# EAGLE design sec_board (EAGLE 8.3.0)
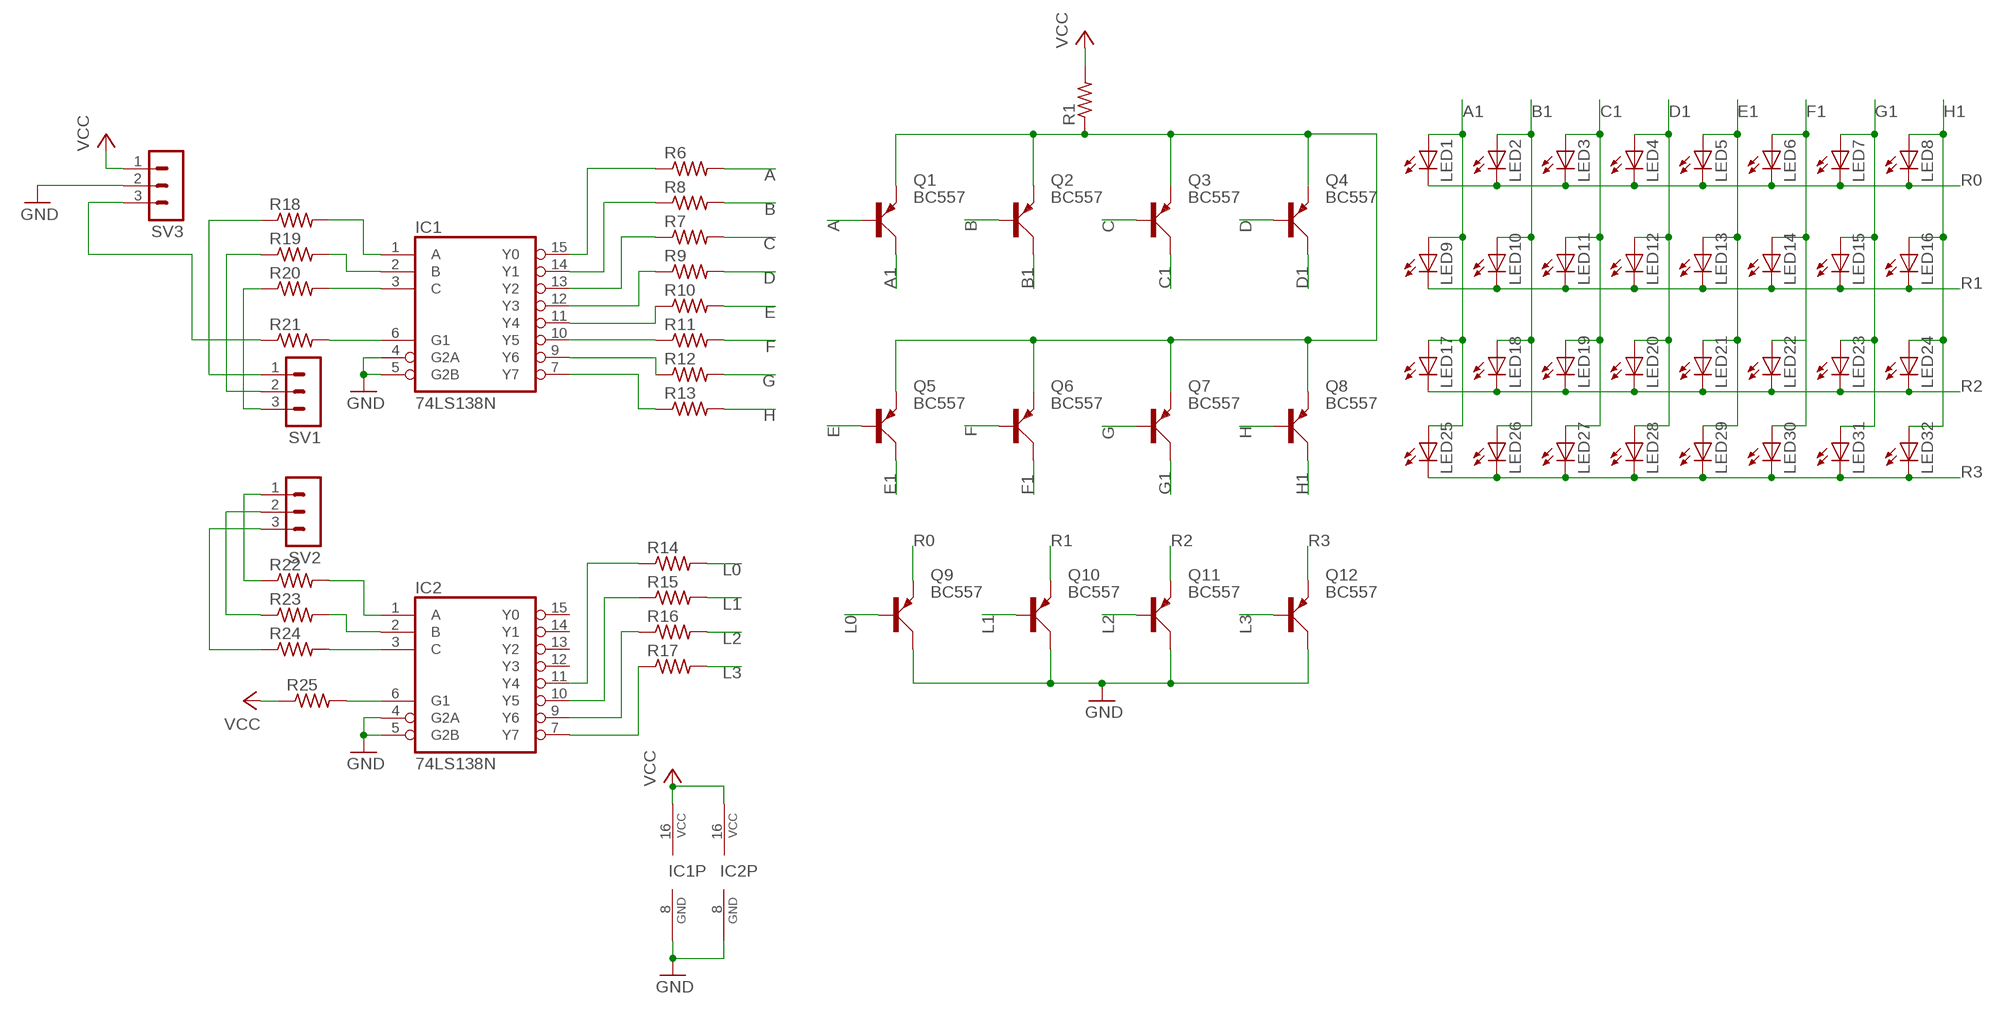
[diagram p0: schematic, sheet 1]

## Parts
IC1  74LS138N  [DIL16]
IC2  74LS138N  [DIL16]
LED1  LED5MM  [LED5MM]
LED2  LED5MM  [LED5MM]
LED3  LED5MM  [LED5MM]
LED4  LED5MM  [LED5MM]
LED5  LED5MM  [LED5MM]
LED6  LED5MM  [LED5MM]
LED7  LED5MM  [LED5MM]
LED8  LED5MM  [LED5MM]
LED9  LED5MM  [LED5MM]
LED10  LED5MM  [LED5MM]
LED11  LED5MM  [LED5MM]
LED12  LED5MM  [LED5MM]
LED13  LED5MM  [LED5MM]
LED14  LED5MM  [LED5MM]
LED15  LED5MM  [LED5MM]
LED16  LED5MM  [LED5MM]
LED17  LED5MM  [LED5MM]
LED18  LED5MM  [LED5MM]
LED19  LED5MM  [LED5MM]
LED20  LED5MM  [LED5MM]
LED21  LED5MM  [LED5MM]
LED22  LED5MM  [LED5MM]
LED23  LED5MM  [LED5MM]
LED24  LED5MM  [LED5MM]
LED25  LED5MM  [LED5MM]
LED26  LED5MM  [LED5MM]
LED27  LED5MM  [LED5MM]
LED28  LED5MM  [LED5MM]
LED29  LED5MM  [LED5MM]
LED30  LED5MM  [LED5MM]
LED31  LED5MM  [LED5MM]
LED32  LED5MM  [LED5MM]
Q1  BC557  [SOT54A]
Q2  BC557  [SOT54A]
Q3  BC557  [SOT54A]
Q4  BC557  [SOT54A]
Q5  BC557  [SOT54A]
Q6  BC557  [SOT54A]
Q7  BC557  [SOT54A]
Q8  BC557  [SOT54A]
Q9  BC557  [SOT54A]
Q10  BC557  [SOT54A]
Q11  BC557  [SOT54A]
Q12  BC557  [SOT54A]
R1  R-US_R0805  [R0805]
R6  R-US_R0805  [R0805]
R7  R-US_R0805  [R0805]
R8  R-US_R0805  [R0805]
R9  R-US_R0805  [R0805]
R10  R-US_R0805  [R0805]
R11  R-US_R0805  [R0805]
R12  R-US_R0805  [R0805]
R13  R-US_R0805  [R0805]
R14  R-US_R0805  [R0805]
R15  R-US_R0805  [R0805]
R16  R-US_R0805  [R0805]
R17  R-US_R0805  [R0805]
R18  R-US_M0805  [M0805]
R19  R-US_M0805  [M0805]
R20  R-US_M0805  [M0805]
R21  R-US_M0805  [M0805]
R22  R-US_M0805  [M0805]
R23  R-US_M0805  [M0805]
R24  R-US_M0805  [M0805]
R25  R-US_M0805  [M0805]
SV1  MA03-1  [MA03-1]
SV2  MA03-1  [MA03-1]
SV3  MA03-1  [MA03-1]

## Nets
A: Q1.B R6.2
A1: LED1.A LED9.A LED17.A LED25.A Q1.C
B: Q2.B R8.2
B1: LED2.A LED10.A LED18.A LED26.A Q2.C
C: Q3.B R7.2
C1: LED3.A LED11.A LED19.A LED27.A Q3.C
D: Q4.B R9.2
D1: LED4.A LED12.A LED20.A LED28.A Q4.C
E: Q5.B R10.2
E1: LED5.A LED13.A LED21.A LED29.A Q5.C
F: Q6.B R11.2
F1: LED6.A LED14.A LED22.A LED30.A Q6.C
G: Q7.B R12.2
G1: LED7.A LED15.A LED23.A LED31.A Q7.C
GND: IC1.4(G2A) IC1.5(G2B) IC1.8(GND) IC2.4(G2A) IC2.5(G2B) IC2.8(GND) Q9.C Q10.C Q11.C Q12.C SV3.2
H: Q8.B R13.2
H1: LED8.A LED16.A LED24.A LED32.A Q8.C
L0: Q9.B R14.2
L1: Q10.B R15.2
L2: Q11.B R16.2
L3: Q12.B R17.2
N$1: IC2.7(Y7) R17.1
N$2: IC1.15(Y0) R6.1
N$4: IC1.14(Y1) R8.1
N$5: IC2.9(Y6) R16.1
N$6: IC1.13(Y2) R7.1
N$7: IC1.12(Y3) R9.1
N$8: IC1.11(Y4) R10.1
N$9: IC1.10(Y5) R11.1
N$10: IC1.9(Y6) R12.1
N$11: IC1.7(Y7) R13.1
N$12: IC2.10(Y5) R15.1
N$13: IC2.11(Y4) R14.1
N$14: Q1.E Q2.E Q3.E Q4.E Q5.E Q6.E Q7.E Q8.E R1.1
N$22: R24.1 SV2.3
N$23: R23.1 SV2.2
N$24: R22.1 SV2.1
N$25: R20.1 SV1.3
N$26: R19.1 SV1.2
N$27: R18.1 SV1.1
N$31: R21.1 SV3.3
N$38: IC2.3(C) R24.2
N$39: IC2.2(B) R23.2
N$40: IC2.1(A) R22.2
N$41: IC1.3(C) R20.2
N$42: IC1.2(B) R19.2
N$43: IC1.1(A) R18.2
N$45: IC1.6(G1) R21.2
N$48: IC2.6(G1) R25.2
R0: LED1.K(C) LED2.K(C) LED3.K(C) LED4.K(C) LED5.K(C) LED6.K(C) LED7.K(C) LED8.K(C) Q9.E
R1: LED9.K(C) LED10.K(C) LED11.K(C) LED12.K(C) LED13.K(C) LED14.K(C) LED15.K(C) LED16.K(C) Q10.E
R2: LED17.K(C) LED18.K(C) LED19.K(C) LED20.K(C) LED21.K(C) LED22.K(C) LED23.K(C) LED24.K(C) Q11.E
R3: LED25.K(C) LED26.K(C) LED27.K(C) LED28.K(C) LED29.K(C) LED30.K(C) LED31.K(C) LED32.K(C) Q12.E
VCC: IC1.16(VCC) IC2.16(VCC) R1.2 R25.1 SV3.1
Unconnected: IC2.12(Y3) IC2.13(Y2) IC2.14(Y1) IC2.15(Y0)

## Library data of the parts
IC1 IC2 = 74xx-us:74*138: 3-line to 8-line DECODER/DEMULTIPLEXER
LED1-LED32 = led:LED: LED OSRAM: - CHIPLED LG R971, LG N971, LY N971, LG Q971, LY Q971, LO R971, LY R971 LH N974, LH R974 LS Q976, LO Q976, LY Q976 LO Q996 - Hyper CHIPLED LW Q18S LB Q993, LB Q99A, LB R99A - SideLED LS A670, LO A670, LY A670, LG A670, LP A670 LB A673, LV A673, LT A673, LW A673 LH A674 LY A675 LS A676, LA A676, LO A676, LY A676, LW A676 LS A679, LY A679, LG A679 - Hyper Micro SIDELED® LS Y876, LA Y876, LO Y876, LY Y876 LT Y87S - SmartLED LW L88C, LW L88S LB L89C, LB L89S, LG L890 LS L89K, LO L89K, LY L89K LS L896, LA L896, LO L896, LY L896 - TOPLED LS T670, LO T670, LY T670, LG T670, LP T670 LSG T670, LSP T670, LSY T670, LOP T670, LYG T670 LG T671, LOG T671, LSG T671 LB T673, LV T673, LT T673, LW T673 LH T674 LS T676, LA T676, LO T676, LY T676, LB T676, LH T676, LSB T676, LW T676 LB T67C, LV T67C, LT T67C, LS T67K, LO T67K, LY T67K, LW E67C LS E67B, LA E67B, LO E67B, LY E67B, LB E67C, LV E67C, LT E67C LW T67C LS T679, LY T679, LG T679 LS T770, LO T770, LY T770, LG T770, LP T770 LB T773, LV T773, LT T773, LW T773 LH T774 LS E675, LA E675, LY E675, LS T675 LS T776, LA T776, LO T776, LY T776, LB T776 LHGB T686 LT T68C, LB T68C - Hyper Mini TOPLED® LB M676 - Mini TOPLED Santana® LG M470 LS M47K, LO M47K, LY M47K Source: http://www.osram.convergy.de LUXEON: - LUMILED® LXK2-PW12-R00, LXK2-PW12-S00, LXK2-PW14-U00, LXK2-PW14-V00 LXK2-PM12-R00, LXK2-PM12-S00, LXK2-PM14-U00 LXK2-PE12-Q00, LXK2-PE12-R00, LXK2-PE12-S00, LXK2-PE14-T00, LXK2-PE14-U00 LXK2-PB12-K00, LXK2-PB12-L00, LXK2-PB12-M00, LXK2-PB14-N00, LXK2-PB14-P00, LXK2-PB14-Q00 LXK2-PR12-L00, LXK2-PR12-M00, LXK2-PR14-Q00, LXK2-PR14-R00 LXK2-PD12-Q00, LXK2-PD12-R00, LXK2-PD12-S00 LXK2-PH12-R00, LXK2-PH12-S00 LXK2-PL12-P00, LXK2-PL12-Q00, LXK2-PL12-R00 Source: www.luxeon.com KINGBRIGHT: KA-3528ASYC Source: www.kingbright.com
Q1-Q12 = transistor-small-signal:BC557: PNP TRANSISTOR
R1 R6-R17 = rcl:R-US_: RESISTOR, American symbol
R18-R25 = resistor:R-US_: RESISTOR, American symbol
SV1-SV3 = con-lstb:MA03-1: PIN HEADER; OC_FARNELL: unknown; OC_NEWARK: unknown

## Board
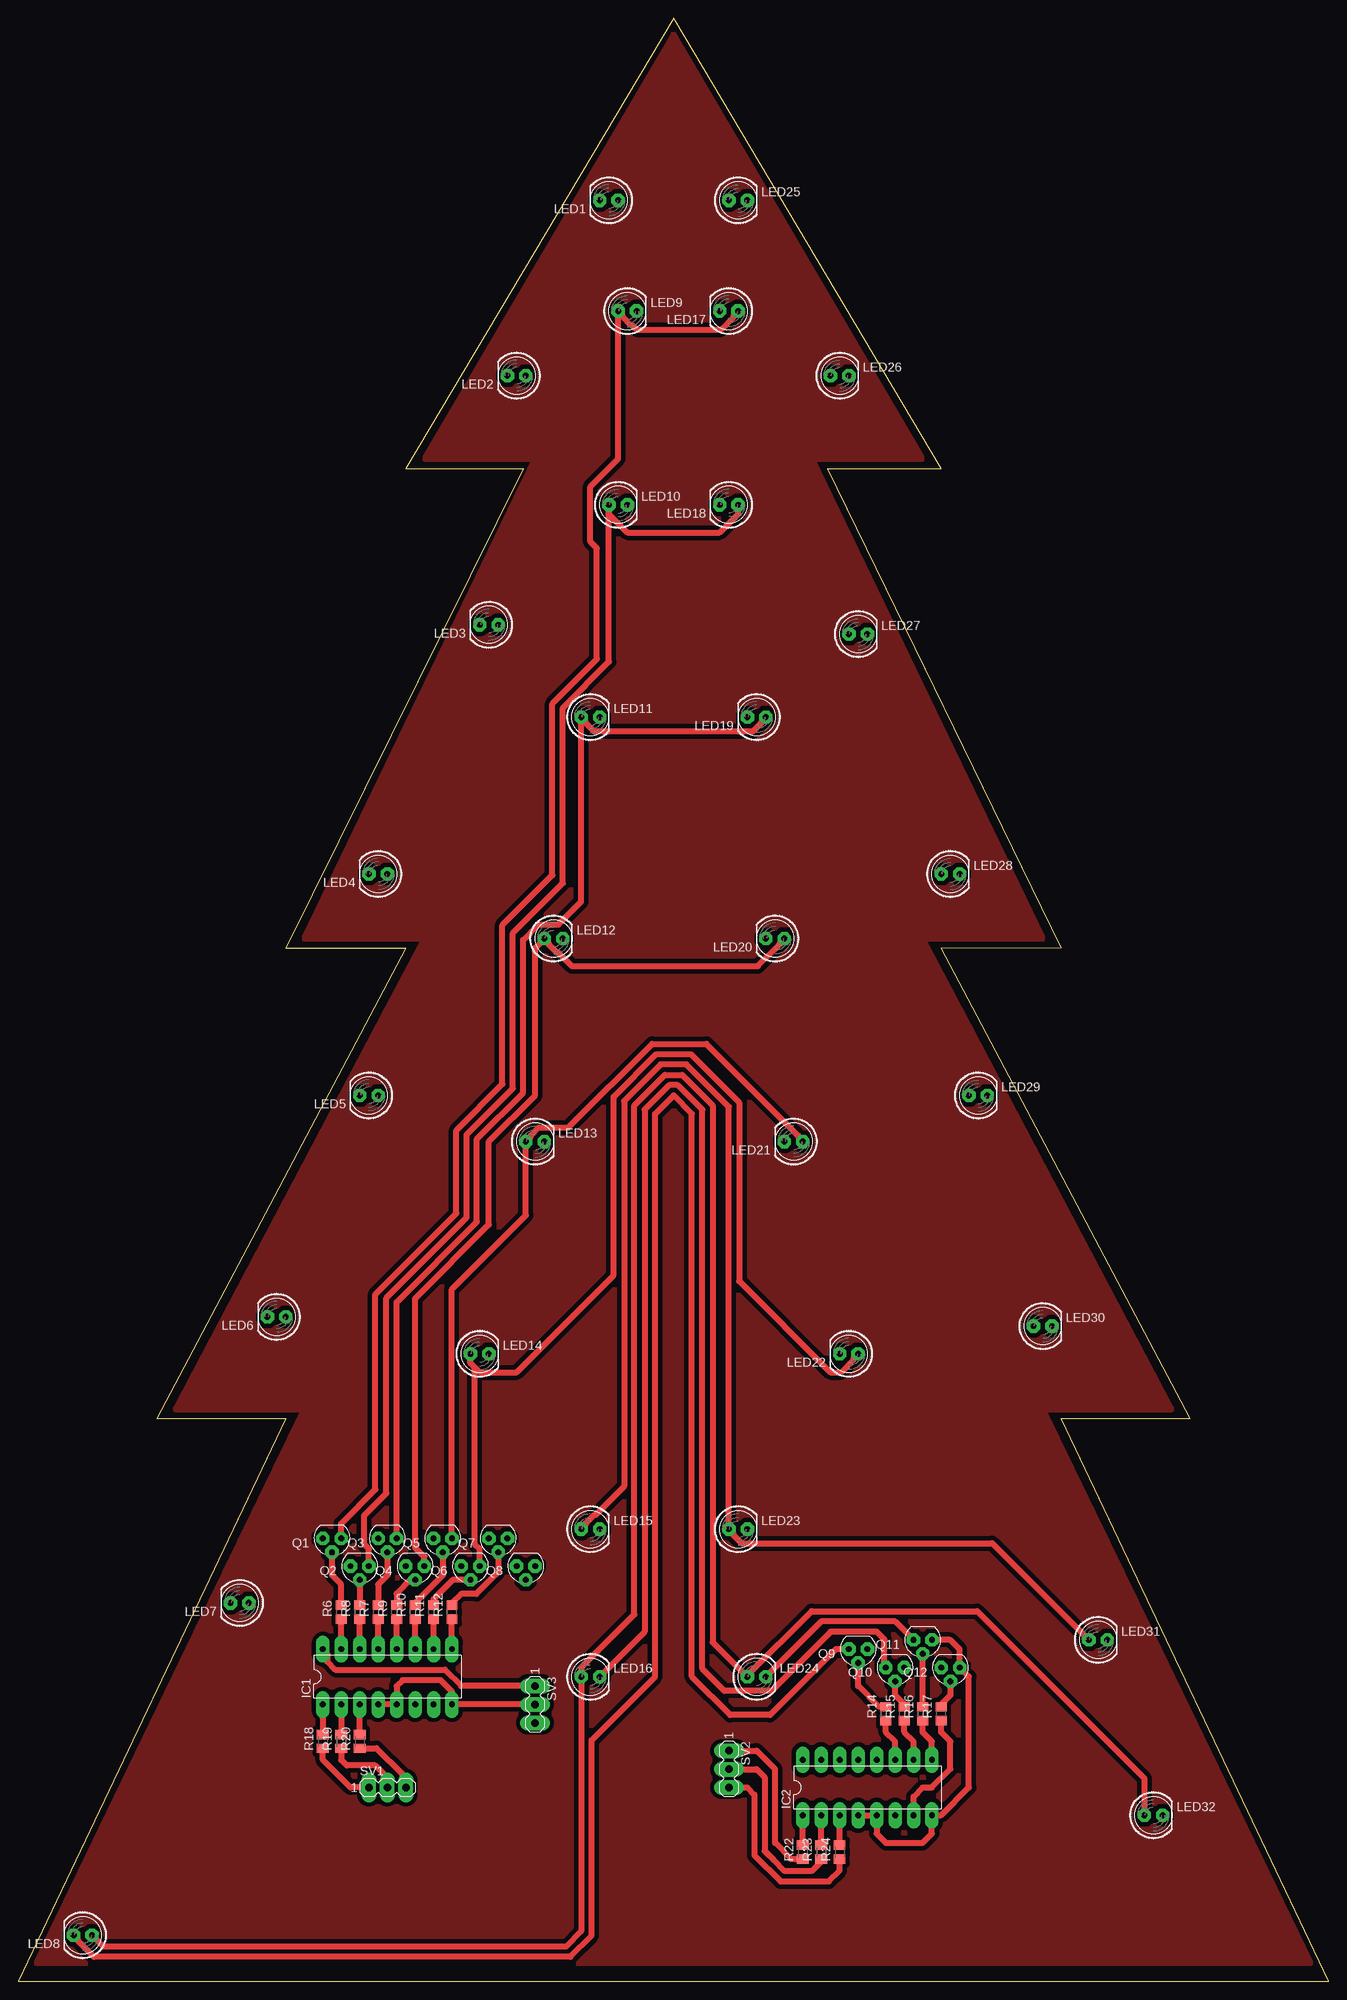
[diagram p1: board, top side]
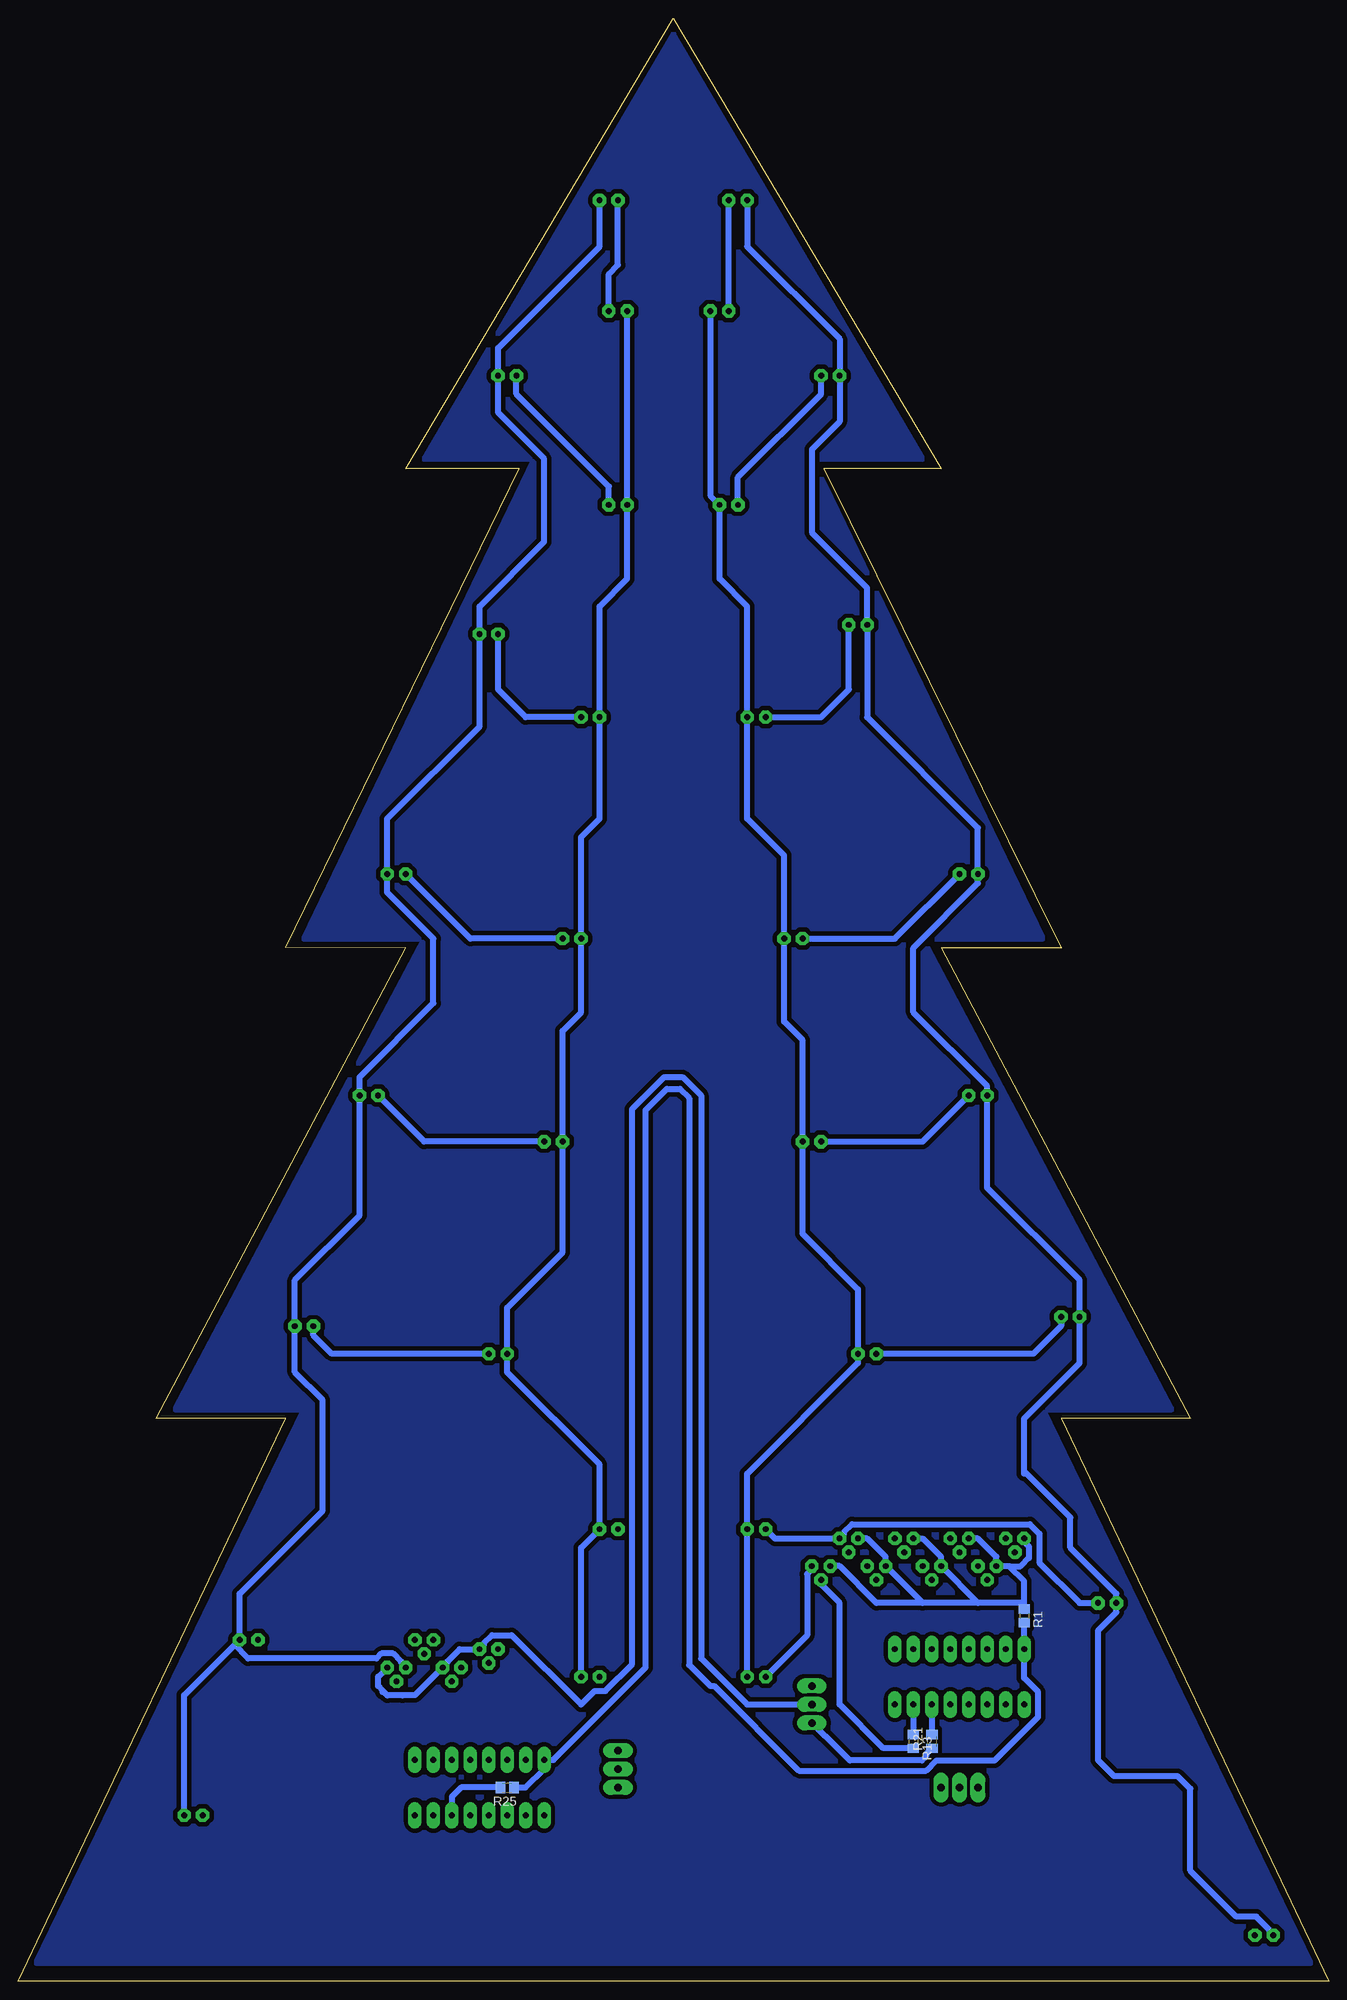
[diagram p2: board, bottom side, seen from below]

Size 180.32 x 270.18 mm. Coordinates in mm from the lower left corner, seen from the top.
Outline: 0,0 180.32,0 143.51,77.47 161.29,77.47 127,142.24 143.49,142.26 111.36,208.2 127,208.15 90.22,270.18 53.34,208.2 69.47,208.15 36.83,142.24 53.34,142.24 19.05,77.47 36.83,77.47 0,0
Copper layers (1*16): Top 0.035mm / dielectric 1.5mm / Bottom 0.035mm
Design rules "LabE *": minimum track width 24mil, minimum drill 1mm, track to track 24mil, track to pad 24mil, pad to pad 16mil, via to via 16mil, smd to smd 8mil, copper to edge 20mil, drill to drill 8mil, minimum pad ring 20mil, minimum via ring 8mil, stop-mask expansion 4mil, vias tented up to drill 0mil, thermal gap 10mil

### Footprints (pad centres in the part's own frame; a part is rotated, then mirrored left to right if it is on the bottom)
DIL16 = drill 0.813 long: 1 -8.89,-3.81; 2 -6.35,-3.81; 3 -3.81,-3.81; 4 -1.27,-3.81; 5 1.27,-3.81; 6 3.81,-3.81; 7 6.35,-3.81; 8 8.89,-3.81; 9 8.89,3.81; 10 6.35,3.81; 11 3.81,3.81; 12 1.27,3.81; 13 -1.27,3.81; 14 -3.81,3.81; 15 -6.35,3.81; 16 -8.89,3.81
LED5MM = drill 0.813 octagon: A -1.27,0; K 1.27,0
SOT54A = drill 0.813 octagon: B 0,1.905; C -1.27,0; E 1.27,0
R0805 = smd 1.3 x 1.5: 1 -0.95,0; 2 0.95,0
M0805 = smd 1.3 x 1.6: 1 -0.95,0; 2 0.95,0
MA03-1 = drill 1.016 long: 1 -2.54,0; 2 0,0; 3 2.54,0

### Placement (x,y rotation side)
IC1  50.8,41.91 0 top
IC2  116.84,26.67 0 top
LED1  81.28,245.11 180 top
LED2  68.58,220.98 180 top
LED3  64.77,186.69 180 top
LED4  49.53,152.4 180 top
LED5  48.26,121.92 180 top
LED6  35.56,91.44 180 top
LED7  30.48,52.07 180 top
LED8  8.89,6.35 180 top
LED9  83.82,229.87 0 top
LED10  82.55,203.2 0 top
LED11  78.74,173.99 0 top
LED12  73.66,143.51 0 top
LED13  71.12,115.57 0 top
LED14  63.5,86.36 0 top
LED15  78.74,62.23 0 top
LED16  78.74,41.91 0 top
LED17  97.79,229.87 180 top
LED18  97.79,203.2 180 top
LED19  101.6,173.99 180 top
LED20  104.14,143.51 180 top
LED21  106.68,115.57 180 top
LED22  114.3,86.36 180 top
LED23  99.06,62.23 0 top
LED24  101.6,41.91 0 top
LED25  99.06,245.11 0 top
LED26  113.03,220.98 0 top
LED27  115.57,185.42 0 top
LED28  128.27,152.4 0 top
LED29  132.08,121.92 0 top
LED30  140.97,90.17 0 top
LED31  148.59,46.99 0 top
LED32  156.21,22.86 0 top
Q1  43.18,60.96 180 top
Q2  46.99,57.15 180 top
Q3  50.8,60.96 180 top
Q4  54.61,57.15 180 top
Q5  58.42,60.96 180 top
Q6  62.23,57.15 180 top
Q7  66.04,60.96 180 top
Q8  69.85,57.15 180 top
Q9  115.57,45.72 180 top
Q10  120.65,43.18 180 top
Q11  124.46,46.99 180 top
Q12  128.27,43.18 180 top
R1  41.91,50.29 270 bottom
R6  44.45,50.8 90 top
R7  49.53,50.8 90 top
R8  46.99,50.8 90 top
R9  52.07,50.8 90 top
R10  54.61,50.8 90 top
R11  57.15,50.8 90 top
R12  59.69,50.8 90 top
R13  57.15,33.02 270 bottom
R14  119.38,36.83 90 top
R15  121.92,36.83 90 top
R16  124.46,36.83 90 top
R17  127,36.83 90 top
R18  41.91,33.02 90 top
R19  44.45,33.02 90 top
R20  46.99,33.02 90 top
R21  54.61,33.02 90 bottom
R22  107.95,17.78 90 top
R23  110.49,17.78 90 top
R24  113.03,17.78 90 top
R25  113.03,26.67 180 bottom
SV1  50.8,26.67 0 top
SV2  97.79,29.21 270 top
SV3  71.12,38.1 270 top

### Tracks (layer width: path | path; a pad name or v marks a point on that pad's centre or on a via)
A
  Top 0.813: R6.2 44.45,54.61 43.18,55.88 Q1.B
A1
  Top 0.813: Q1.C 44.45,62.97 49.16,67.68 49.16,94.56 60.28,105.69 60.28,117.12 66.63,123.47 66.63,145.37 73.51,152.25 73.51,175.85 79.64,181.98 79.64,197.22 78.74,198.12 78.74,205.74 82.55,209.55 LED9.A 83.16,229.26 83.16,229.07 84.29,227.94 84.48,227.94 85.09,227.33 96.71,227.33 98.45,229.07 | 98.45,229.26 98.45,229.07 | 98.45,229.26 LED17.A | 98.45,229.07 98.45,229.26
  Bottom 0.813: LED17.A 99.06,234.95 97.79,236.22 LED25.A | LED9.A LED1.A
B
  Top 0.813: Q2.B 46.99,52.07 | 46.99,51.52 46.99,52.07 | 46.99,52.07 46.99,51.52 | R8.2 46.99,51.52
B1
  Top 0.813: Q2.C 48.26,59.5 47.6,60.16 47.6,64.11 50.65,67.16 50.65,94.04 61.71,105.1 61.71,116.53 68.06,122.88 68.06,144.26 74.93,151.13 74.93,175.26 81.28,181.61 LED10.A 81.28,201.93 83.82,199.39 96.52,199.39 99.06,201.93 LED18.A
  Bottom 0.813: LED18.A 99.06,205.74 111.76,218.44 LED26.A | LED10.A 81.28,207.01 69.85,218.44 LED2.A
C
  Top 0.813: Q3.B 50.8,55.88 49.53,54.61 R7.2
C1
  Top 0.813: Q3.C 52.07,93.45 63.13,104.51 63.13,115.94 69.48,122.29 69.48,143.33 71.59,145.44 74.32,145.44 77.47,148.59 LED11.A 78.08,173.38 78.08,173.19 79.21,172.06 101.13,172.06 102.26,173.19 102.26,173.38 LED19.A
  Bottom 0.813: LED19.A 110.49,173.99 114.3,177.8 LED27.A | LED11.A 69.85,173.99 66.04,177.8 LED3.A
D
  Top 0.813: Q4.B 54.16,55.24 54.14,55.22 53.95,55.22 52.07,53.34 R9.2
D1
  Top 0.813: Q4.C 55.88,58.42 54.61,59.69 54.61,93.98 64.77,104.14 64.77,115.57 71.12,121.92 71.12,142.24 LED12.A 73,142.9 73,142.71 74.13,141.58 74.32,141.58 76.2,139.7 101.79,139.7 104.8,142.71 104.8,142.9 LED20.A
  Bottom 0.813: LED20.A 118.11,143.51 LED28.A | LED12.A 59.69,143.51 LED4.A
E
  Top 0.813: Q5.B 58.42,55.88 54.61,52.07 | 54.61,52.07 54.61,51.73 | 54.61,51.73 54.61,51.52 54.61,51.73 | R10.2 54.61,52.07
E1
  Top 0.813: Q5.C 59.69,95.25 69.85,105.41 LED13.A 70.46,116.18 70.46,116.37 71.59,117.5 75.69,117.5 87.22,129.03 94.68,129.03 107.34,116.37 107.34,116.18 LED21.A
  Bottom 0.813: LED21.A 124.46,115.57 LED29.A | LED13.A 55.88,115.57 LED5.A
F
  Top 0.813: Q6.B 61.78,55.24 61.76,55.22 59.77,55.22 57.52,52.97 57.52,52.95 57.15,52.58 R11.2
F1
  Top 0.813: LED14.A 62.23,85.09 62.84,84.48 | 62.84,84.48 63.5,83.82 68.58,83.82 81.94,97.18 81.94,121.74 87.81,127.61 92.53,127.61 99.21,120.92 99.21,96.37 111.76,83.82 113.22,83.82 114.96,85.56 114.96,85.75 LED22.A | Q6.C 63.5,59.5 62.84,60.16 62.84,84.48
  Bottom 0.813: LED6.A 36.83,90.17 40.64,86.36 LED14.A | LED22.A 137.16,86.36 139.7,88.9 LED30.A
G
  Top 0.813: Q7.B 66.04,56.33 63.03,53.31 60.94,53.31 59.69,52.07 R12.2
G1
  Top 0.813: LED31.A 134.01,60.3 99.53,60.3 98.4,61.43 98.4,61.62 LED23.A 97.79,120.33 91.94,126.19 88.4,126.19 83.36,121.15 83.36,68.12 79.4,64.16 79.21,64.16 78.08,63.03 78.08,62.84 LED15.A
  Bottom 0.813: LED15.A 76.2,60.96 Q7.C 66.7,61.57 66.7,61.76 65.57,62.89 41.11,62.89 39.83,61.61 39.83,57.61 34.29,52.07 LED7.A
GND
  Top 0.813: Q11.C 128.27,46.99 129.54,45.72 Q12.C 130.81,41.91 130.81,26.67 127,22.86 IC2.8 125.73,20.32 124.46,19.05 119.38,19.05 118.11,20.32 IC2.5 IC2.4 | SV3.2 IC1.8 59.69,39.9 58.14,41.45 52.88,41.45 52.07,40.64 52.07,38.63 51.54,38.1 | 51.54,38.1 IC1.5 | 51.54,38.1 IC1.4
  Bottom 0.813: 130.18,40.01 129.51,39.34 127.47,39.34 127.44,39.37 125.73,39.37 Q10.C 121.31,43.79 121.31,43.98 119.57,45.72 Q9.C 116.23,46.33 116.23,46.52 115.1,47.65 112.42,47.65 102.87,38.1 100.99,39.98 99.53,39.98 95.86,43.65 95.86,120.04 91.44,124.46 88.9,124.46 86.36,121.92 86.36,44.45 80.01,38.1 SV3.2 | 130.18,40.01 130.81,40.64 130.81,41.91 Q12.C | 130.18,40.01 130.18,39.84
H
  Bottom 0.813: R13.2 61.28,32.07 67.31,38.1 67.31,52.07 69.85,54.61 Q8.B
H1
  Top 0.813: LED32.A 154.94,27.94 131.93,50.95 109.18,50.95 100.33,42.1 LED24.A 95.56,46.69 95.56,120.56 91.35,124.77 88.99,124.77 84.78,120.56 84.78,50.49 77.47,43.18 LED16.A 77.47,6.88 75.38,4.79 11.72,4.79 LED8.A
  Bottom 0.813: Q8.C 71.12,56.7 71.78,56.05 71.78,47.6 LED16.A
L0
  Top 0.813: R14.2 118.43,37.78 115.57,40.64 Q9.B
L1
  Top 0.813: R15.2 121.92,38.1 120.65,39.37 Q10.B
L2
  Top 0.813: R16.2 Q11.B
L3
  Top 0.813: Q12.B 128.27,39.37 127,38.1 R17.2
N$1
  Top 0.813: IC2.7 123.19,25.4 124.46,26.67 125.73,26.67 128.27,29.21 128.27,33.02 127,34.29 R17.1
N$2
  Top 0.813: IC1.15 R6.1
N$3
  pour Top: 90.17,267.97 55.88,209.55 71.12,209.55 39.37,143.51 55.88,143.51 21.59,78.74 39.37,78.74 2.54,2.54 177.8,2.54 140.97,78.74 158.75,78.74 124.46,143.51 140.97,143.51 109.22,209.55 124.46,209.55
  pour Bottom: 90.17,267.97 124.46,209.55 109.22,209.55 140.97,143.51 124.46,143.51 158.75,78.74 140.97,78.74 177.8,2.54 2.54,2.54 39.37,78.74 21.59,78.74 55.88,143.51 39.37,143.51 71.12,209.55 55.88,209.55
N$4
  Top 0.813: IC1.14 R8.1
N$5
  Top 0.813: IC2.9 125.73,33.02 124.46,34.29 R16.1
N$6
  Top 0.813: IC1.13 R7.1
N$7
  Top 0.813: IC1.12 R9.1
N$8
  Top 0.813: IC1.11 R10.1
N$9
  Top 0.813: IC1.10 R11.1
N$10
  Top 0.813: IC1.9 R12.1
N$11
  Bottom 0.813: IC1.7 R13.1
N$12
  Top 0.813: IC2.10 123.19,33.02 121.92,34.29 R15.1
N$13
  Top 0.813: IC2.11 120.65,33.02 119.38,34.29 R14.1
N$14
  Bottom 0.813: Q3.E 48.26,60.96 45.72,58.42 Q2.E 45.7,57.12 43.94,57.12 | Q7.E 63.5,60.96 60.96,58.42 Q6.E 55.88,52.07 | Q1.E 41.91,60.52 41.25,59.85 41.25,58.26 42.38,57.12 43.94,57.12 | R1.1 41.91,52.07 | 41.91,52.07 41.91,55.09 43.94,57.12 | 41.91,52.07 48.26,52.07 | 48.26,52.07 Q4.E 53.34,58.42 55.88,60.96 Q5.E | 48.26,52.07 55.88,52.07 | 55.88,52.07 62.23,52.07 67.31,57.15 Q8.E
N$22
  Top 0.813: SV2.3 100.33,26.67 101.3,25.7 101.3,17.34 104.9,13.74 106.08,13.74 | 106.08,13.74 | R24.1 113.03,15.24 111.53,13.74 106.08,13.74 | R24.1 113.03,17.06 R24.1
N$23
  Top 0.813: SV2.2 101.6,29.21 102.72,28.09 102.72,17.93 103.93,16.72 | R23.1 110.49,16.48 109.17,15.16 105.49,15.16 103.93,16.72 | 103.93,16.72 102.87,17.78
N$24
  Top 0.813: SV2.1 101.6,31.75 103.9,29.45 | 103.9,29.45 104.14,29.21 | R22.1 106.36,16.83 104.14,19.05 104.14,29.21 | 104.14,29.21 103.9,29.45
N$25
  Top 0.813: R20.1 49.29,32.07 52.83,28.53 52.83,28.45 53.34,27.94 SV1.3
N$26
  Top 0.813: SV1.2 50.29,27.18 50.29,28.53 49.1,29.72 45.21,29.72 44.45,30.48 44.45,31.84 | 44.45,31.84 44.45,32.3 | R19.1 44.45,31.84
N$27
  Top 0.813: SV1.1 45.72,26.67 41.91,30.48 R18.1
N$31
  Bottom 0.813: SV3.3 69.34,33.78 69.26,33.78 65.88,30.4 55.98,30.4 55.38,31 55.38,31.3 R21.1
N$38
  Top 0.813: R24.2 IC2.3
N$39
  Top 0.813: R23.2 IC2.2
N$40
  Top 0.813: R22.2 IC2.1
N$41
  Top 0.813: R20.2 IC1.3
N$42
  Top 0.813: IC1.2 R19.2
N$43
  Top 0.813: IC1.1 R18.2
N$45
  Bottom 0.813: IC1.6 R21.2
N$48
  Bottom 0.813: R25.2 119.38,26.67 120.65,25.4 IC2.6
R0
  Top 0.813: Q9.E 112.5,45.72 103.46,36.68 97.94,36.68 92.71,41.91 92.71,119.38 90.17,121.92 87.65,119.4 | LED8.K 8.23,5.74 8.23,5.55 10.41,3.37 75.97,3.37 78.89,6.29 78.89,33.17 87.63,41.91 87.63,119.38 | 87.65,119.4 87.63,119.38 | 87.63,119.38 87.65,119.4
  Bottom 0.813: 41.91,70.17 41.91,69.85 | 41.91,70.17 41.91,77.47 34.29,85.09 LED6.K 34.29,96.52 46.99,109.22 LED5.K 46.99,123.19 57.15,133.35 57.15,142.24 48.26,151.13 LED4.K 48.26,158.75 63.5,173.99 LED3.K 63.5,191.77 71.12,199.39 71.12,210.82 67.31,214.63 LED2.K 67.31,226.06 80.01,238.76 LED1.K | LED8.K 8.23,6.96 8.23,7.15 9.97,8.89 12.7,8.89 19.05,15.24 19.05,26.5 20.79,28.25 29.52,28.25 31.75,30.48 31.75,48.26 29.21,50.8 LED7.K 29.21,53.34 35.56,59.69 35.56,63.82 41.91,70.17
R1
  Top 0.813: Q10.E 119.19,43.37 119.19,47.04 118.12,48.11 111.8,48.11 103.67,39.98 97.18,39.98 94.13,43.03 94.13,119.97 90.76,123.34 89.58,123.34 86.21,119.97 86.21,48.11 LED16.K
  Bottom 0.813: LED9.K 85.09,204.47 LED10.K 83.82,193.04 80.01,189.23 LED11.K 80.01,160.02 74.93,154.94 LED12.K 74.93,132.08 72.39,129.54 LED13.K 72.39,102.87 64.77,95.25 LED14.K 64.77,85.09 80.01,69.85 LED15.K LED16.K
R2
  Top 0.813: LED24.K 110.49,49.53 120.65,49.53 Q11.E
  Bottom 0.813: LED24.K 102.87,59.69 LED23.K | LED23.K 100.33,63.5 | LED17.K LED18.K 96.52,193.04 100.33,189.23 LED19.K 100.33,160.02 102.87,157.48 LED20.K 102.87,133.35 105.41,130.81 LED21.K 105.41,100.33 113.03,92.71 LED22.K 113.03,83.82 100.33,71.12 LED23.K
R3
  Bottom 0.813: LED32.K 157.48,39.37 150.55,46.3 | 150.55,46.3 LED31.K 149.86,53.34 138.43,64.77 138.43,80.01 142.24,83.82 LED30.K 142.24,96.52 133.35,105.41 LED29.K 133.35,124.46 123.19,134.62 123.19,143.51 129.54,149.86 LED28.K 129.54,160.02 116.84,172.72 LED27.K 116.84,189.23 107.95,198.12 107.95,209.55 114.3,215.9 LED26.K 114.3,224.79 100.33,238.76 LED25.K | Q12.E 127.61,43.79 127.61,43.98 128.74,45.11 130.34,45.11 131,44.45 148.71,44.45 150.55,46.3
VCC
  Top 0.813: IC1.16 42.52,45.11 42.52,44.01 43.65,42.88 58.73,42.88 60.96,40.64 SV3.1
  Bottom 0.813: R25.1 110.49,26.67 107.95,29.21 IC2.16 106.68,30.48 93.98,43.18 93.98,119.91 91.07,122.82 89.27,122.82 88,121.55 88,43.55 85.09,40.64 84.56,40.64 72.9,28.98 55.39,28.98 53.97,30.4 45.96,30.4 39.98,36.39 39.98,39.81 41.91,41.74 IC1.16 R1.2